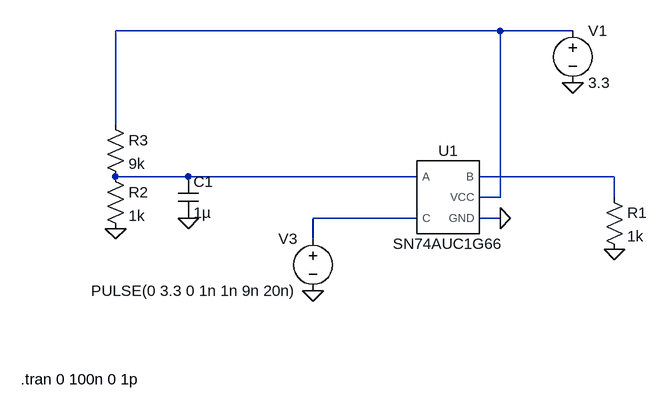
[diagram p0: schematic trans_gate_demo.asc]
trans_gate_demo.asc, the LTspice schematic file:
Version 4
SHEET 1 880 680
WIRE 240 -144 -352 -144
WIRE 352 -144 240 -144
WIRE -352 0 -352 -144
WIRE -240 80 -352 80
WIRE 112 80 -240 80
WIRE 416 80 208 80
WIRE 240 112 240 -144
WIRE 240 112 208 112
WIRE 416 112 416 80
WIRE 112 144 -48 144
WIRE 240 144 208 144
WIRE -48 176 -48 144
FLAG 352 -64 0
FLAG -48 256 0
FLAG 416 192 0
FLAG -352 160 0
FLAG -240 144 0
FLAG 240 144 0
SYMBOL voltage 352 -160 R0
WINDOW 123 0 0 Left 0
WINDOW 39 0 0 Left 0
SYMATTR InstName V1
SYMATTR Value 3.3
SYMBOL voltage -48 160 M0
WINDOW 123 0 0 Left 0
WINDOW 39 0 0 Left 0
SYMATTR InstName V3
SYMATTR Value PULSE(0 3.3 0 1n 1n 9n 20n)
SYMBOL res 400 96 R0
SYMATTR InstName R1
SYMATTR Value 1k
SYMBOL res -368 64 R0
SYMATTR InstName R2
SYMATTR Value 1k
SYMBOL res -368 -16 R0
SYMATTR InstName R3
SYMATTR Value 9k
SYMBOL cap -256 80 R0
SYMATTR InstName C1
SYMATTR Value 1µ
SYMBOL SN74AUC1G66 160 112 R0
SYMATTR InstName U1
TEXT -498 392 Left 2 !.tran 0 100n 0 1p

The netlist it stands for:
* trans_gate_demo.asc
V1 N001 0 3.3
V3 N004 0 PULSE(0 3.3 0 1n 1n 9n 20n)
R1 N003 0 1k
R2 N002 0 1k
R3 N001 N002 9k
C1 N002 0 1µ
XU1 N002 N003 N004 N001 0 SN74AUC1G66  ; pins A B C VCC GND
.tran 0 100n 0 1p
.lib sn74auc1g66.lib
.backanno
.end